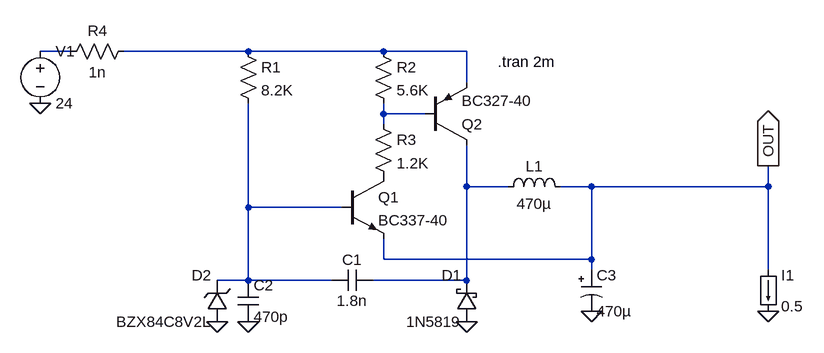
[diagram p0: schematic VideoVoeding.asc]
VideoVoeding.asc, the LTspice schematic file:
Version 4
SHEET 1 880 680
WIRE -384 -32 -432 -32
WIRE -112 -32 -304 -32
WIRE 96 -32 -112 -32
WIRE 224 -32 96 -32
WIRE 224 16 224 -32
WIRE 96 64 96 48
WIRE 160 64 96 64
WIRE 96 80 96 64
WIRE 224 176 224 112
WIRE 288 176 224 176
WIRE 416 176 368 176
WIRE 688 176 688 144
WIRE 688 176 416 176
WIRE -112 208 -112 48
WIRE 32 208 -112 208
WIRE 96 288 96 256
WIRE 416 288 416 176
WIRE 416 288 96 288
WIRE 416 304 416 288
WIRE 688 304 688 176
WIRE -112 320 -112 208
WIRE -112 320 -160 320
WIRE 16 320 -112 320
WIRE 224 320 224 176
WIRE 224 320 80 320
FLAG -160 384 0
FLAG -112 384 0
FLAG 224 384 0
FLAG 416 368 0
FLAG 688 368 0
FLAG -432 48 0
FLAG 688 144 OUT
IOPIN 688 144 Out
SYMBOL res -128 -48 R0
SYMATTR InstName R1
SYMATTR Value 8.2K
SYMBOL res 80 -48 R0
SYMATTR InstName R2
SYMATTR Value 5.6K
SYMBOL res 80 64 R0
SYMATTR InstName R3
SYMATTR Value 1.2K
SYMBOL cap 80 304 R90
WINDOW 0 0 32 VBottom 0
WINDOW 3 32 32 VTop 0
SYMATTR InstName C1
SYMATTR Value 1.8n
SYMBOL cap -128 320 R0
SYMATTR InstName C2
SYMATTR Value 470p
SYMBOL schottky 240 384 R180
WINDOW 0 24 72 Left 0
WINDOW 3 24 0 Left 0
SYMATTR InstName D1
SYMATTR Value 1N5819
SYMATTR Description Diode
SYMATTR Type diode
SYMBOL polcap 400 304 R0
WINDOW 3 24 64 Left 0
SYMATTR InstName C3
SYMATTR Value 470µ
SYMATTR Description Capacitor
SYMATTR Type cap
SYMATTR SpiceLine V=4 Irms=1 Rser=0.07 Lser=0
SYMBOL ind 272 192 R270
WINDOW 0 32 56 VTop 0
WINDOW 3 5 56 VBottom 0
SYMATTR InstName L1
SYMATTR Value 470µ
SYMATTR SpiceLine Ipk=3 Rser=0.2 Rpar=14000 Cpar=7.9p
SYMBOL npn 32 160 R0
SYMATTR InstName Q1
SYMATTR Value BC337-40
SYMBOL pnp 160 112 M180
SYMATTR InstName Q2
SYMATTR Value BC327-40
SYMBOL voltage -432 -48 R0
WINDOW 123 0 0 Left 0
WINDOW 39 0 0 Left 0
SYMATTR InstName V1
SYMATTR Value 24
SYMBOL res -288 -48 R90
WINDOW 0 0 56 VBottom 0
WINDOW 3 32 56 VTop 0
SYMATTR InstName R4
SYMATTR Value 1n
SYMBOL load 672 304 R0
WINDOW 123 0 0 Left 0
WINDOW 39 0 0 Left 0
SYMATTR InstName I1
SYMATTR Value 0.5
SYMBOL zener -144 384 R180
WINDOW 0 24 72 Left 0
WINDOW 3 24 0 Left 0
SYMATTR InstName D2
SYMATTR Value BZX84C8V2L
TEXT 272 -16 Left 0 !.tran 2m

The netlist it stands for:
* VideoVoeding.asc
R1 N002 N005 8.2K
R2 N002 N003 5.6K
R3 N003 P001 1.2K
C1 N004 N005 1.8n
C2 N005 0 470p
D1 0 N004 1N5819
C3 OUT 0 470µ V=4 Irms=1 Rser=0.07 Lser=0
L1 N004 OUT 470µ Ipk=3 Rser=0.2 Rpar=14000 Cpar=7.9p
Q1 P001 N005 OUT 0 BC337-40
Q2 N004 N003 N002 0 BC327-40
V1 N001 0 24
R4 N002 N001 1n
I1 OUT 0 0.5
D2 0 N005 BZX84C8V2L
.model D D
.lib standard.dio
.model NPN NPN
.model PNP PNP
.lib standard.bjt
.tran 2m
.backanno
.end